# EAGLE design ws1_try (EAGLE 9.6.2)
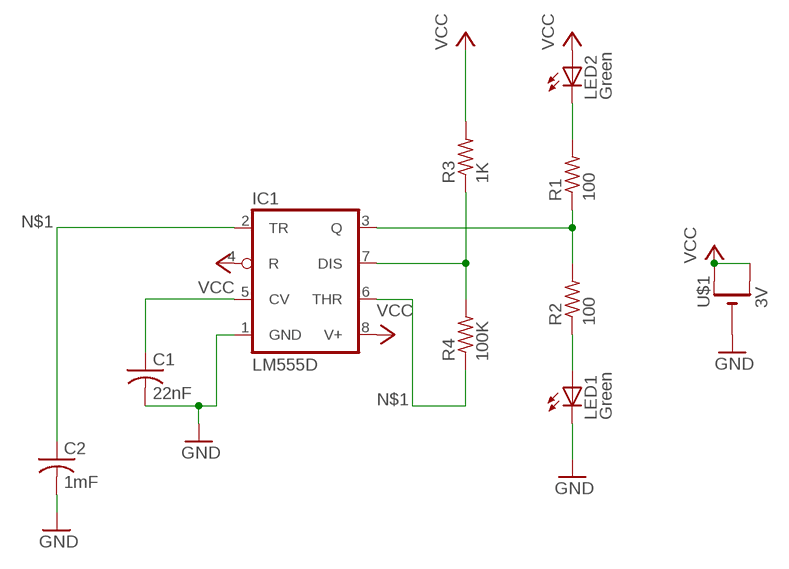
[diagram p0: schematic, sheet 1]

## Parts
C1  22nF  C-USC0805  [C0805]
C2  1mF  C-USC0805  [C0805]
IC1  LM555D  [SO08]
LED1  Green  LEDCHIP-LED0805  [CHIP-LED0805]
LED2  Green  LEDCHIP-LED0805  [CHIP-LED0805]
R1  100  R-US_R0805  [R0805]
R2  100  R-US_R0805  [R0805]
R3  1K  R-US_R0805  [R0805]
R4  100K  R-US_R0805  [R0805]
U$1  3V  CR1220SMT  [CR1220-SMD]

## Nets
GND: C1.2 C2.2 IC1.1(GND) LED1.C U$1.-
N$1: C2.1 IC1.2(TR) IC1.6(THR) R4.1
N$2: C1.1 IC1.5(CV)
N$3: LED2.C R1.2
N$4: IC1.3(Q) R1.1 R2.2
N$5: LED1.A R2.1
N$6: IC1.7(DIS) R3.1 R4.2
VCC: IC1.4(R) IC1.8(V+) LED2.A R3.2 U$1.+$1(+) U$1.+$2(+1)

## Library data of the parts
C1 C2 = adafruit:C-US: CAPACITOR, American symbol
IC1 = adafruit:*555: TIMER Changed DIP package to have round (not oval) pin pads http://www.ladyada.net/library/pcb/eaglelibrary.html
LED1 LED2 = adafruit:LED: LED OSRAM: - CHIPLED LG R971, LG N971, LY N971, LG Q971, LY Q971, LO R971, LY R971 LH N974, LH R974 LS Q976, LO Q976, LY Q976 LO Q996 - Hyper CHIPLED LW Q18S LB Q993, LB Q99A, LB R99A - SideLED LS A670, LO A670, LY A670, LG A670, LP A670 LB A673, LV A673, LT A673, LW A673 LH A674 LY A675 LS A676, LA A676, LO A676, LY A676, LW A676 LS A679, LY A679, LG A679 - Hyper Micro SIDELED® LS Y876, LA Y876, LO Y876, LY Y876 LT Y87S - SmartLED LW L88C, LW L88S LB L89C, LB L89S, LG L890 LS L89K, LO L89K, LY L89K LS L896, LA L896, LO L896, LY L896 - TOPLED LS T670, LO T670, LY T670, LG T670, LP T670 LSG T670, LSP T670, LSY T670, LOP T670, LYG T670 LG T671, LOG T671, LSG T671 LB T673, LV T673, LT T673, LW T673 LH T674 LS T676, LA T676, LO T676, LY T676, LB T676, LH T676, LSB T676, LW T676 LB T67C, LV T67C, LT T67C, LS T67K, LO T67K, LY T67K, LW E67C LS E67B, LA E67B, LO E67B, LY E67B, LB E67C, LV E67C, LT E67C LW T67C LS T679, LY T679, LG T679 LS T770, LO T770, LY T770, LG T770, LP T770 LB T773, LV T773, LT T773, LW T773 LH T774 LS E675, LA E675, LY E675, LS T675 LS T776, LA T776, LO T776, LY T776, LB T776 LHGB T686 LT T68C, LB T68C - Hyper Mini TOPLED® LB M676 - Mini TOPLED Santana® LG M470 LS M47K, LO M47K, LY M47K Source: http://www.osram.convergy.de/
R1-R4 = adafruit:R-US_: RESISTOR, American symbol
U$1 = adafruit:CR1220: CR1216/CR1220/CR1225 12mm 3V lithium coin cell Great for battery packup. Both SMT and THM holders. Note the THM package has the ground pads on both sides of the PCB so that the masks are the same - this reduces the cost

## Board
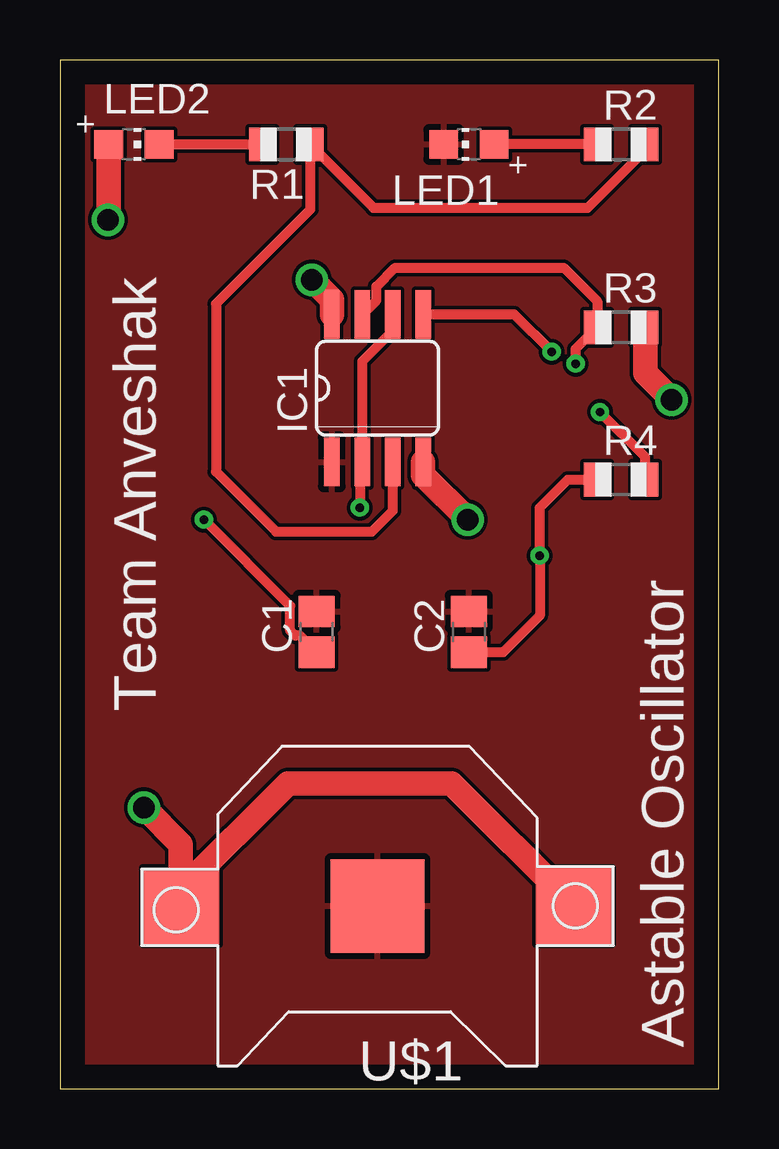
[diagram p1: board, top side]
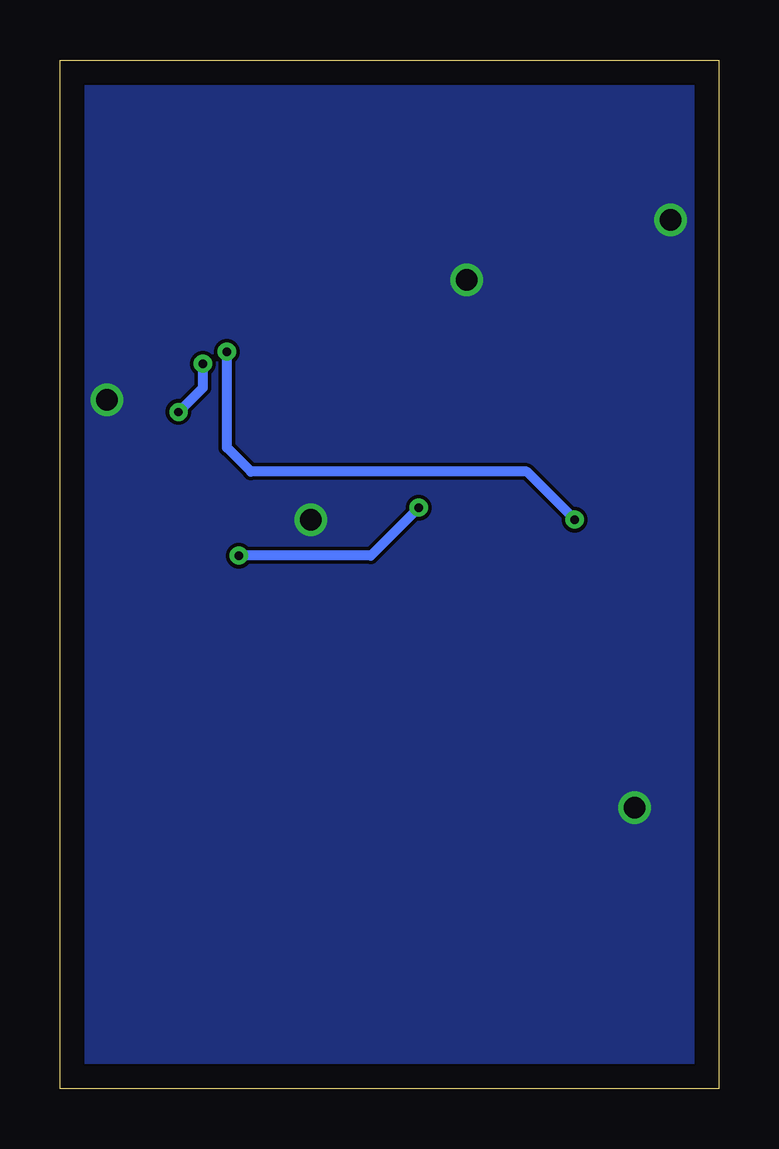
[diagram p2: board, bottom side, seen from below]

Size 27.46 x 42.89 mm. Coordinates in mm from the lower left corner, seen from the top.
Outline: 0,0 27.46,0 27.46,42.89 0,42.89 0,0
Copper layers (1*16): Top 0.035mm / dielectric 1.5mm / Bottom 0.035mm
Design rules "default": minimum track width 6mil, minimum drill 0.35mm, track to track 6mil, track to pad 6mil, pad to pad 6mil, via to via 6mil, smd to smd 6mil, copper to edge 40mil, drill to drill 6mil, minimum pad ring 10mil, minimum via ring 8mil, stop-mask expansion 4mil, vias tented up to drill 0mil, thermal gap 10mil

### Footprints (pad centres in the part's own frame; a part is rotated, then mirrored left to right if it is on the bottom)
C0805 = smd 1.3 x 1.5: 1 -0.85,0; 2 0.85,0
SO08 = smd 0.66 x 2.032: 1 -1.905,-3.073; 2 -0.635,-3.073; 3 0.635,-3.073; 4 1.905,-3.073; 5 1.905,3.073; 6 0.635,3.073; 7 -0.635,3.073; 8 -1.905,3.073
CHIP-LED0805 = smd 1.2 x 1.2: A 0,-1.05; C 0,1.05
R0805 = smd 1.1 x 1.4: 1 -1,0; 2 1,0
CR1220-SMD = smd 3.2 x 3.2: +$1 -8.2,0; +$2 8.2,0 | smd 3.9 x 3.9: - 0,0

### Placement (x,y rotation side)
C1  10.7,19.05 90 top
C2  17.05,19.05 90 top
IC1  13.24,29.21 0 top
LED1  17.05,39.37 90 top
LED2  3.08,39.37 270 top
R1  9.43,39.37 180 top
R2  23.4,39.37 0 top
R3  23.4,31.75 0 top
R4  23.4,25.4 0 top
U$1  13.24,7.62 180 top

### Tracks (layer width: path | path; a pad name or v marks a point on that pad's centre or on a via)
GND
  pour Top: 0.5,43.23 27.5,43.23 27.5,-0.27 0.5,-0.27
N$1  (via drill 0.35)
  Top 0.406: v12.5,24.23 12.5,26.03 IC1.2 12.61,30.34 14,31.73 14,32.16 IC1.6 | R4.1 21.17,25.4 20,24.23 v20,22.23 20,19.73 18.47,18.2 C2.1
  Bottom 0.406: v12.5,24.23 14.5,22.23 v20,22.23
N$2  (via drill 0.35)
  Top 0.406: v6,23.73 9.59,20.14 9.59,19.1 9.8,18.89 10.01,18.89 C1.1 | v20.5,30.73 18.95,32.28 IC1.5
  Bottom 0.406: v6,23.73 8,25.73 19.5,25.73 20.5,26.73 v20.5,30.73
N$3
  Top 0.406: LED2.C R1.2
N$4
  Top 0.406: IC1.3 13.88,24.11 13,23.23 9,23.23 6.5,25.73 6.5,32.73 10.43,36.66 R1.1 13.07,36.73 22,36.73 24.4,39.13 R2.2
N$5
  Top 0.406: R2.1 LED1.A
N$6  (via drill 0.35)
  Top 0.406: IC1.7 13.19,32.87 13.19,33.45 13.97,34.23 21,34.23 22.4,32.83 R3.1 21.5,30.85 v21.5,30.23 | R4.2 24.4,26.33 v22.52,28.21
  Bottom 0.406: v22.52,28.21 21.5,29.23 v21.5,30.23
VCC  (via drill 0.9)
  Top 1.016: 5.04,8.27 5.04,10.19 v3.5,11.73 | U$1.+$1 16.33,12.73 9.5,12.73 5.04,8.27 | 5.04,8.27 U$1.+$2 | LED2.A 2.03,36.26 v2,36.23 | IC1.4 15.14,25.59 v17,23.73 | IC1.8 11.34,32.89 v10.5,33.73 | v25.5,28.73 24.4,29.83 R3.2
  pour Bottom: -0.5,43.73 27.5,43.73 27.5,-0.27 -0.5,-0.27
  pour Bottom: 0,43.23 27.5,43.23 27.5,-0.27 0,-0.27

### Text on the board
tPlace: Team Anveshak | Astable Oscillator